# Altium schematic sheet gamePadRL.SchDoc
size A4
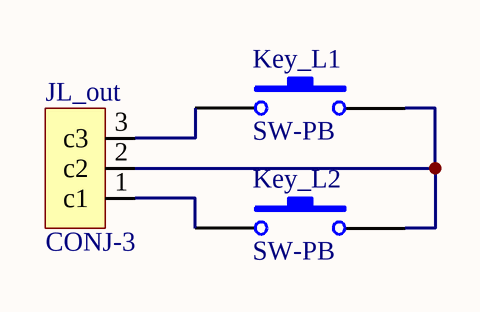
[diagram p0: gamePadRL.SchDoc]

## Parts
JL_out  CONJ-3  [sip-3]
Key_L1  SW-PB  [gamepadbig]
Key_L2  SW-PB  [gamepadbig]

## Nets
NetJL_out_1: JL_out.1(c1) Key_L2.1
NetJL_out_2: JL_out.2(c2) Key_L1.2 Key_L2.2
NetJL_out_3: JL_out.3(c3) Key_L1.1

## Library data of the parts
Key_L1 Key_L2 = SW-PB: Switch; Published: 24-Mar-1999; LatestRevisionDate: 17-Jul-2002; LatestRevisionNote: Re-released for DXP Platform.; PackageReference: SPST-2; Publisher: Altium Limited